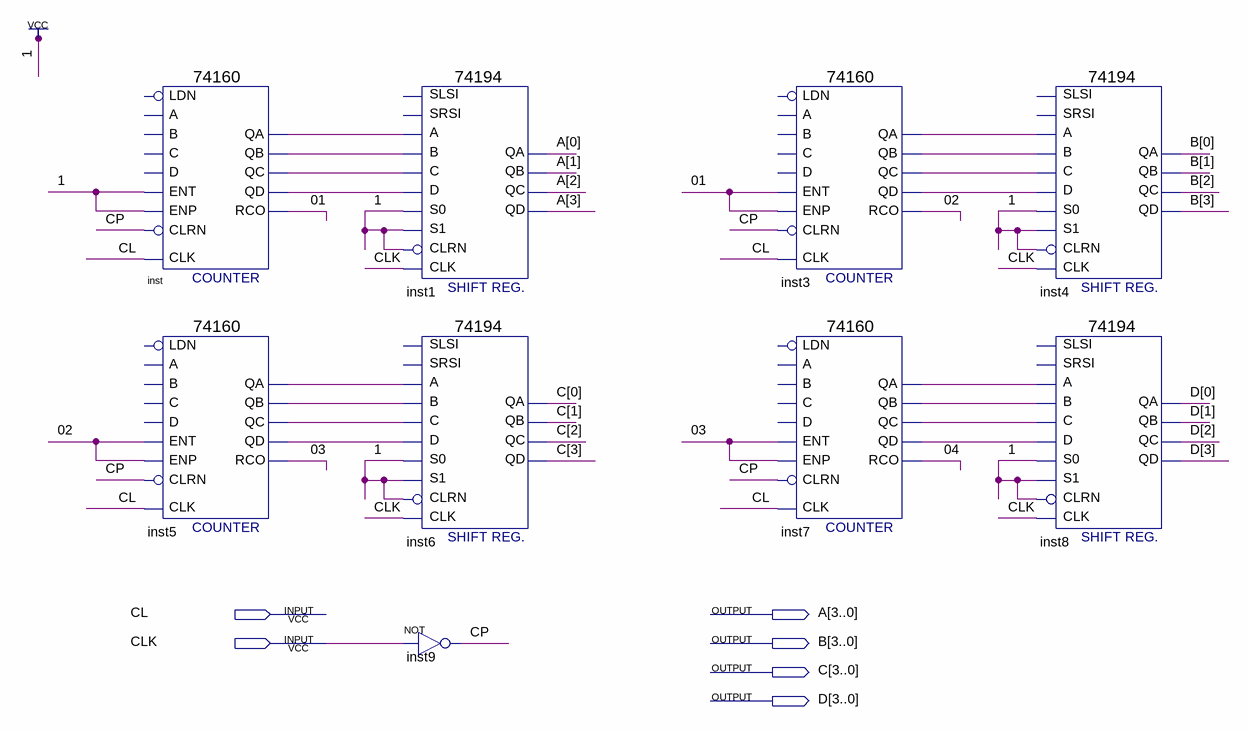
[diagram p0: schematic sheet]
// Quartus schematic CEPIN2.bdf as structural Verilog: 9 symbols, 6 pins
module CEPIN2 (
  input  CL,
  input  CLK,
  output [3:0] A,
  output [3:0] B,
  output [3:0] C,
  output [3:0] D
);

  wire \01 , \02 , \03 , \04 , CP, inst3_qa, inst3_qb, inst3_qc, inst3_qd, inst5_qa, inst5_qb, inst5_qc,
       inst5_qd, inst7_qa, inst7_qb, inst7_qc, inst7_qd, inst_qa, inst_qb, inst_qc, inst_qd;

  \74160  inst (
    .CLK(CL), .ENT(1'b1), .ENP(1'b1), .CLRN(CP), .QD(inst_qd), .QA(inst_qa), .QB(inst_qb), .QC(inst_qc),
    .RCO(\01 ));  // open: A, B, C, D, LDN
  \74160  inst5 (
    .CLK(CL), .ENT(\02 ), .ENP(\02 ), .CLRN(CP), .QD(inst5_qd), .QA(inst5_qa), .QB(inst5_qb), .QC(inst5_qc),
    .RCO(\03 ));  // open: A, B, C, D, LDN
  \74194  inst1 (
    .B(inst_qb), .C(inst_qc), .CLK(CLK), .CLRN(1'b1), .D(inst_qd), .S1(1'b1), .S0(1'b1), .A(inst_qa),
    .QA(A[0]), .QB(A[1]), .QC(A[2]), .QD(A[3]));  // open: SLSI, SRSI
  \74194  inst6 (
    .B(inst5_qb), .C(inst5_qc), .CLK(CLK), .CLRN(1'b1), .D(inst5_qd), .S1(1'b1), .S0(1'b1), .A(inst5_qa),
    .QA(C[0]), .QB(C[1]), .QC(C[2]), .QD(C[3]));  // open: SLSI, SRSI
  not inst9 (CP, CLK);
  \74160  inst3 (
    .CLK(CL), .ENT(\01 ), .ENP(\01 ), .CLRN(CP), .QD(inst3_qd), .QA(inst3_qa), .QB(inst3_qb), .QC(inst3_qc),
    .RCO(\02 ));  // open: A, B, C, D, LDN
  \74160  inst7 (
    .CLK(CL), .ENT(\03 ), .ENP(\03 ), .CLRN(CP), .QD(inst7_qd), .QA(inst7_qa), .QB(inst7_qb), .QC(inst7_qc),
    .RCO(\04 ));  // open: A, B, C, D, LDN
  \74194  inst4 (
    .B(inst3_qb), .C(inst3_qc), .CLK(CLK), .CLRN(1'b1), .D(inst3_qd), .S1(1'b1), .S0(1'b1), .A(inst3_qa),
    .QA(B[0]), .QB(B[1]), .QC(B[2]), .QD(B[3]));  // open: SLSI, SRSI
  \74194  inst8 (
    .B(inst7_qb), .C(inst7_qc), .CLK(CLK), .CLRN(1'b1), .D(inst7_qd), .S1(1'b1), .S0(1'b1), .A(inst7_qa),
    .QA(D[0]), .QB(D[1]), .QC(D[2]), .QD(D[3]));  // open: SLSI, SRSI
endmodule
